# EAGLE design ALU (EAGLE 9.6.2)
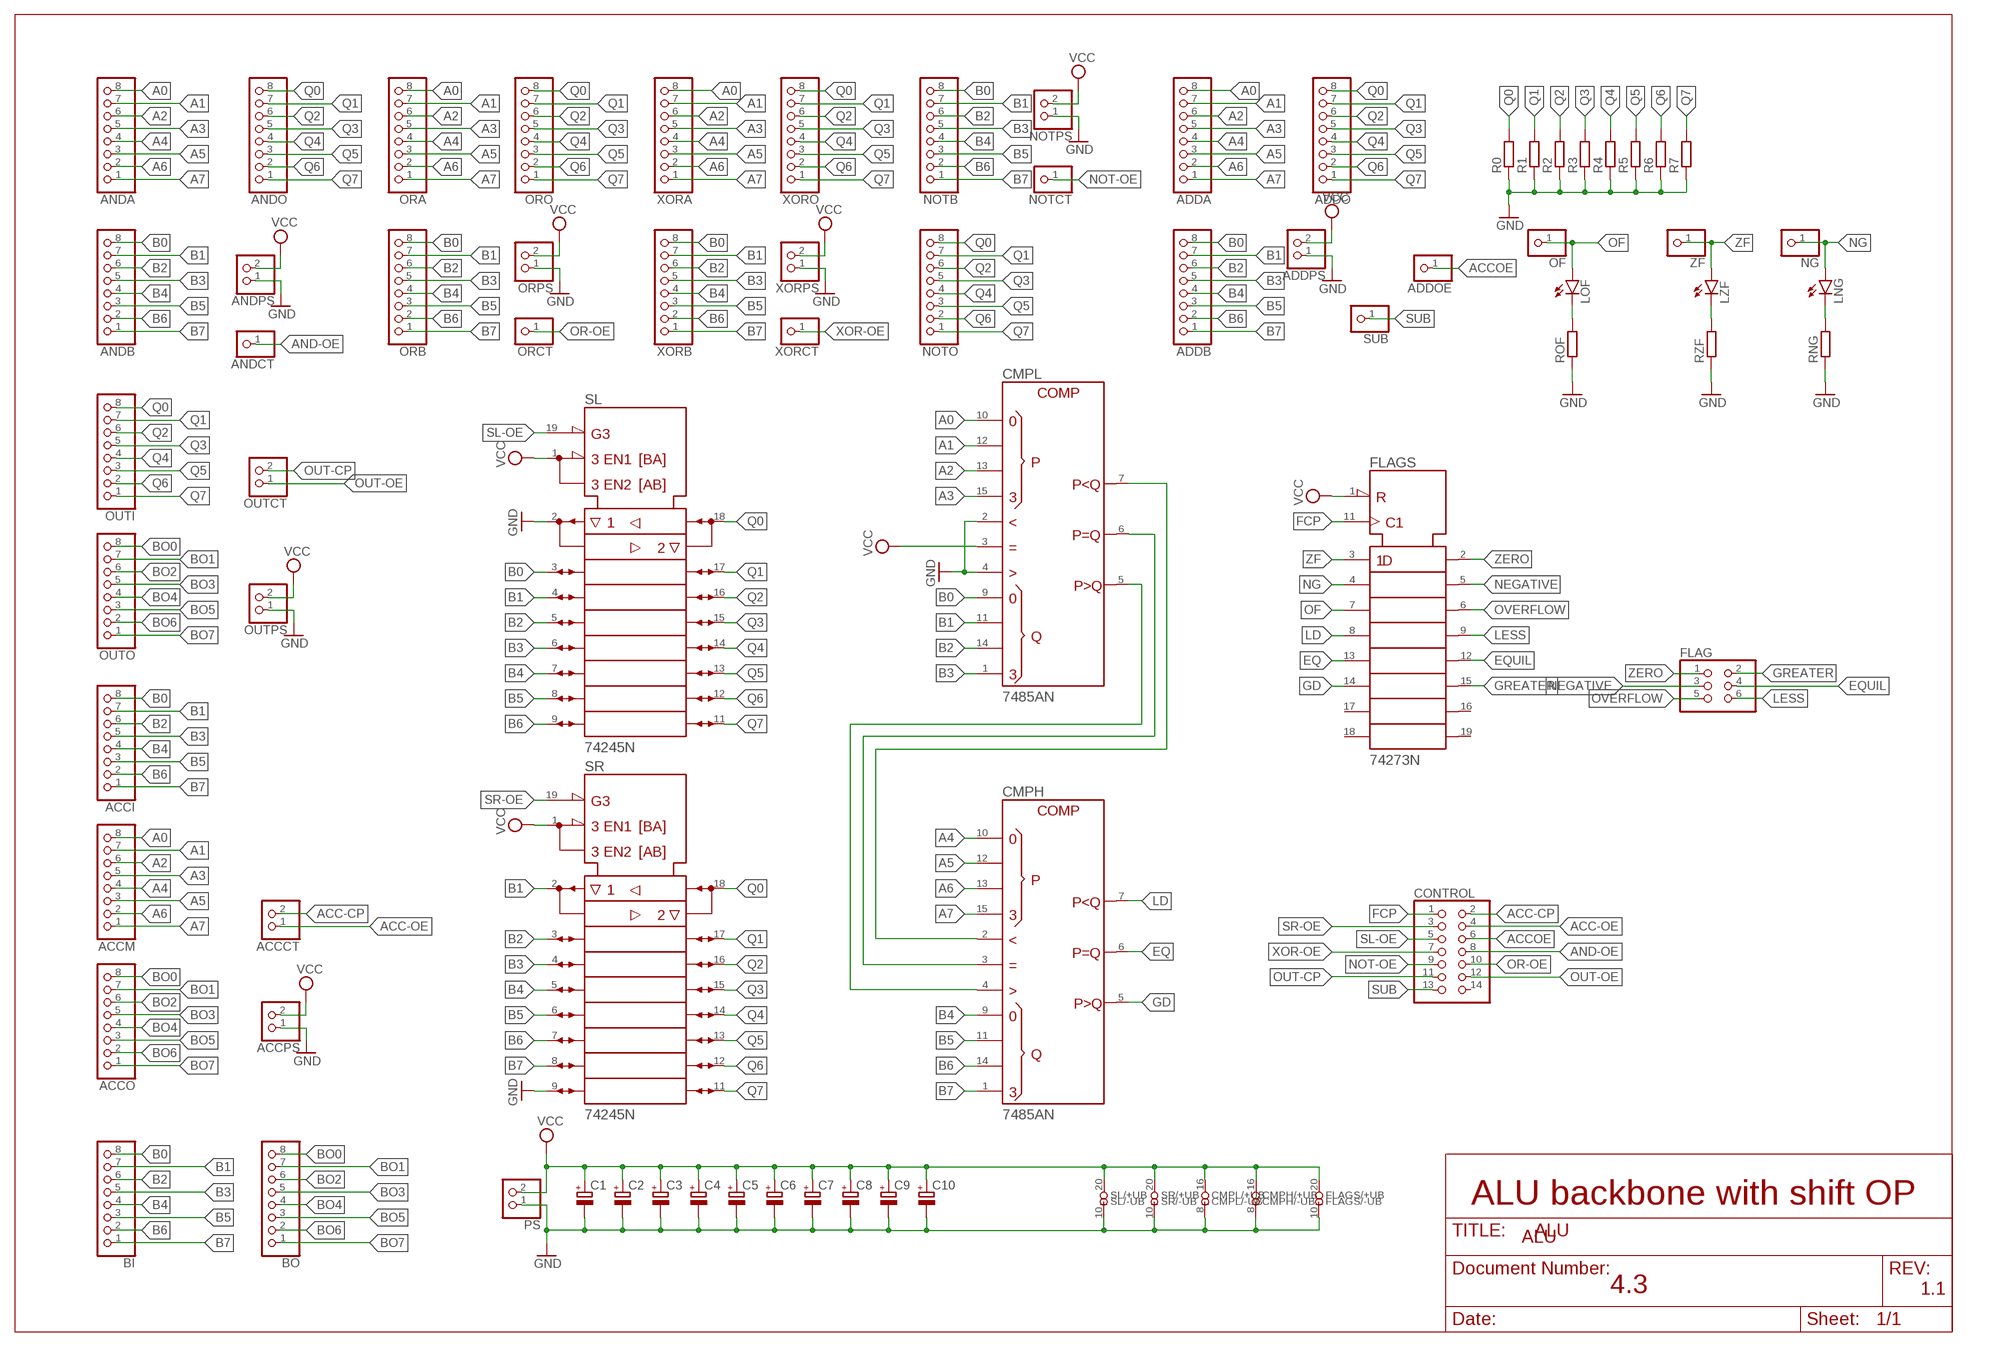
[diagram p0: schematic, sheet 1]

## Parts
ACCCT  PINHD-1X2  [1X02]
ACCI  PINHD-1X8  [1X08]
ACCM  PINHD-1X8  [1X08]
ACCO  PINHD-1X8  [1X08]
ACCPS  PINHD-1X2  [1X02]
ADDA  PINHD-1X8  [1X08]
ADDB  PINHD-1X8  [1X08]
ADDO  PINHD-1X8  [1X08]
ADDOE  PINHD-1X1  [1X01]
ADDPS  PINHD-1X2  [1X02]
ANDA  PINHD-1X8  [1X08]
ANDB  PINHD-1X8  [1X08]
ANDCT  PINHD-1X1  [1X01]
ANDO  PINHD-1X8  [1X08]
ANDPS  PINHD-1X2  [1X02]
BI  PINHD-1X8  [1X08]
BO  PINHD-1X8  [1X08]
C1  CPOL-EUE2.5-6  [E2,5-6]
C2  CPOL-EUE2.5-6  [E2,5-6]
C3  CPOL-EUE2.5-6  [E2,5-6]
C4  CPOL-EUE2.5-6  [E2,5-6]
C5  CPOL-EUE2.5-6  [E2,5-6]
C6  CPOL-EUE2.5-6  [E2,5-6]
C7  CPOL-EUE2.5-6  [E2,5-6]
C8  CPOL-EUE2.5-6  [E2,5-6]
C9  CPOL-EUE2.5-6  [E2,5-6]
C10  CPOL-EUE2.5-6  [E2,5-6]
CMPH  7485AN  [DIL16]
CMPL  7485AN  [DIL16]
CONTROL  PINHD-2X7  [2X07]
FLAG  PINHD-2X3  [2X03]
FLAGS  74273N  [DIL20]
LNG  LED5MM  [LED5MM]
LOF  LED5MM  [LED5MM]
LZF  LED5MM  [LED5MM]
NG  PINHD-1X1  [1X01]
NOTB  PINHD-1X8  [1X08]
NOTCT  PINHD-1X1  [1X01]
NOTO  PINHD-1X8  [1X08]
NOTPS  PINHD-1X2  [1X02]
OF  PINHD-1X1  [1X01]
ORA  PINHD-1X8  [1X08]
ORB  PINHD-1X8  [1X08]
ORCT  PINHD-1X1  [1X01]
ORO  PINHD-1X8  [1X08]
ORPS  PINHD-1X2  [1X02]
OUTCT  PINHD-1X2  [1X02]
OUTI  PINHD-1X8  [1X08]
OUTO  PINHD-1X8  [1X08]
OUTPS  PINHD-1X2  [1X02]
PS  PINHD-1X2  [1X02]
R0  R-EU_0204/7  [0204/7]
R1  R-EU_0204/7  [0204/7]
R2  R-EU_0204/7  [0204/7]
R3  R-EU_0204/7  [0204/7]
R4  R-EU_0204/7  [0204/7]
R5  R-EU_0204/7  [0204/7]
R6  R-EU_0204/7  [0204/7]
R7  R-EU_0204/7  [0204/7]
RNG  R-EU_0204/7  [0204/7]
ROF  R-EU_0204/7  [0204/7]
RZF  R-EU_0204/7  [0204/7]
SL  74245N  [DIL20]
SR  74245N  [DIL20]
SUB  PINHD-1X1  [1X01]
XORA  PINHD-1X8  [1X08]
XORB  PINHD-1X8  [1X08]
XORCT  PINHD-1X1  [1X01]
XORO  PINHD-1X8  [1X08]
XORPS  PINHD-1X2  [1X02]
ZF  PINHD-1X1  [1X01]

## Nets
A0: ACCM.8 ADDA.8 ANDA.8 CMPL.10(P0) ORA.8 XORA.8
A1: ACCM.7 ADDA.7 ANDA.7 CMPL.12(P1) ORA.7 XORA.7
A2: ACCM.6 ADDA.6 ANDA.6 CMPL.13(P2) ORA.6 XORA.6
A3: ACCM.5 ADDA.5 ANDA.5 CMPL.15(P3) ORA.5 XORA.5
A4: ACCM.4 ADDA.4 ANDA.4 CMPH.10(P0) ORA.4 XORA.4
A5: ACCM.3 ADDA.3 ANDA.3 CMPH.12(P1) ORA.3 XORA.3
A6: ACCM.2 ADDA.2 ANDA.2 CMPH.13(P2) ORA.2 XORA.2
A7: ACCM.1 ADDA.1 ANDA.1 CMPH.15(P3) ORA.1 XORA.1
ACC-CP: ACCCT.2 CONTROL.2
ACC-OE: ACCCT.1 CONTROL.4
ACCOE: ADDOE.1 CONTROL.6
AND-OE: ANDCT.1 CONTROL.8
B0: ACCI.8 ADDB.8 ANDB.8 BI.8 CMPL.9(Q0) NOTB.8 ORB.8 SL.3(A2) XORB.8
B1: ACCI.7 ADDB.7 ANDB.7 BI.7 CMPL.11(Q1) NOTB.7 ORB.7 SL.4(A3) SR.2(A1) XORB.7
B2: ACCI.6 ADDB.6 ANDB.6 BI.6 CMPL.14(Q2) NOTB.6 ORB.6 SL.5(A4) SR.3(A2) XORB.6
B3: ACCI.5 ADDB.5 ANDB.5 BI.5 CMPL.1(Q3) NOTB.5 ORB.5 SL.6(A5) SR.4(A3) XORB.5
B4: ACCI.4 ADDB.4 ANDB.4 BI.4 CMPH.9(Q0) NOTB.4 ORB.4 SL.7(A6) SR.5(A4) XORB.4
B5: ACCI.3 ADDB.3 ANDB.3 BI.3 CMPH.11(Q1) NOTB.3 ORB.3 SL.8(A7) SR.6(A5) XORB.3
B6: ACCI.2 ADDB.2 ANDB.2 BI.2 CMPH.14(Q2) NOTB.2 ORB.2 SL.9(A8) SR.7(A6) XORB.2
B7: ACCI.1 ADDB.1 ANDB.1 BI.1 CMPH.1(Q3) NOTB.1 ORB.1 SR.8(A7) XORB.1
BO0: ACCO.8 BO.8 OUTO.8
BO1: ACCO.7 BO.7 OUTO.7
BO2: ACCO.6 BO.6 OUTO.6
BO3: ACCO.5 BO.5 OUTO.5
BO4: ACCO.4 BO.4 OUTO.4
BO5: ACCO.3 BO.3 OUTO.3
BO6: ACCO.2 BO.2 OUTO.2
BO7: ACCO.1 BO.1 OUTO.1
EQ: CMPH.6(PEQQ) FLAGS.13(5D)
EQUIL: FLAG.4 FLAGS.12(5Q)
FCP: CONTROL.1 FLAGS.11(CLK)
GD: CMPH.5(PGTQ) FLAGS.14(6D)
GND: ACCPS.1 ADDPS.1 ANDPS.1 C1.- C2.- C3.- C4.- C5.- C6.- C7.- C8.- C9.- C10.- CMPH.8(-UB) CMPL.2(PLTQ_) CMPL.4(PGTQ_) CMPL.8(-UB) FLAGS.10(-UB) NOTPS.1 ORPS.1 OUTPS.1 PS.1 R0.1 R1.1 R2.1 R3.1 R4.1 R5.1 R6.1 R7.1 RNG.1 ROF.1 RZF.1 SL.2(A1) SL.10(-UB) SR.9(A8) SR.10(-UB) XORPS.1
GREATER: FLAG.2 FLAGS.15(6Q)
LD: CMPH.7(PLTQ) FLAGS.8(4D)
LESS: FLAG.6 FLAGS.9(4Q)
N$1: LOF.K(C) ROF.2
N$2: LZF.K(C) RZF.2
N$3: LNG.K(C) RNG.2
N$26: CMPH.4(PGTQ_) CMPL.5(PGTQ)
N$27: CMPH.3(PEQQ_) CMPL.6(PEQQ)
N$28: CMPH.2(PLTQ_) CMPL.7(PLTQ)
NEGATIVE: FLAG.3 FLAGS.5(2Q)
NG: FLAGS.4(2D) LNG.A NG.1
NOT-OE: CONTROL.9 NOTCT.1
OF: FLAGS.7(3D) LOF.A OF.1
OR-OE: CONTROL.10 ORCT.1
OUT-CP: CONTROL.11 OUTCT.2
OUT-OE: CONTROL.12 OUTCT.1
OVERFLOW: FLAG.5 FLAGS.6(3Q)
Q0: ADDO.8 ANDO.8 NOTO.8 ORO.8 OUTI.8 R0.2 SL.18(B1) SR.18(B1) XORO.8
Q1: ADDO.7 ANDO.7 NOTO.7 ORO.7 OUTI.7 R1.2 SL.17(B2) SR.17(B2) XORO.7
Q2: ADDO.6 ANDO.6 NOTO.6 ORO.6 OUTI.6 R2.2 SL.16(B3) SR.16(B3) XORO.6
Q3: ADDO.5 ANDO.5 NOTO.5 ORO.5 OUTI.5 R3.2 SL.15(B4) SR.15(B4) XORO.5
Q4: ADDO.4 ANDO.4 NOTO.4 ORO.4 OUTI.4 R4.2 SL.14(B5) SR.14(B5) XORO.4
Q5: ADDO.3 ANDO.3 NOTO.3 ORO.3 OUTI.3 R5.2 SL.13(B6) SR.13(B6) XORO.3
Q6: ADDO.2 ANDO.2 NOTO.2 ORO.2 OUTI.2 R6.2 SL.12(B7) SR.12(B7) XORO.2
Q7: ADDO.1 ANDO.1 NOTO.1 ORO.1 OUTI.1 R7.2 SL.11(B8) SR.11(B8) XORO.1
SL-OE: CONTROL.5 SL.19(!G)
SR-OE: CONTROL.3 SR.19(!G)
SUB: CONTROL.13 SUB.1
VCC: ACCPS.2 ADDPS.2 ANDPS.2 C1.+ C2.+ C3.+ C4.+ C5.+ C6.+ C7.+ C8.+ C9.+ C10.+ CMPH.16(+UB) CMPL.3(PEQQ_) CMPL.16(+UB) FLAGS.1(!CLR) FLAGS.20(+UB) NOTPS.2 ORPS.2 OUTPS.2 PS.2 SL.1(DIR) SL.20(+UB) SR.1(DIR) SR.20(+UB) XORPS.2
XOR-OE: CONTROL.7 XORCT.1
ZERO: FLAG.1 FLAGS.2(1Q)
ZF: FLAGS.3(1D) LZF.A ZF.1
Unconnected: CONTROL.14 FLAGS.16(7Q) FLAGS.17(7D) FLAGS.18(8D) FLAGS.19(8Q)

## Notes on the sheet
- ALU backbone with shift OP
- ALU
- 4.3 | 1.1

## Library data of the parts
ACCCT ACCPS ADDPS ANDPS NOTPS ORPS OUTCT OUTPS PS XORPS = pinhead:PINHD-1X2: PIN HEADER
ACCI ACCM ACCO ADDA ADDB ADDO ANDA ANDB ANDO BI BO NOTB NOTO ORA ORB ORO OUTI OUTO XORA XORB XORO = pinhead:PINHD-1X8: PIN HEADER
ADDOE ANDCT NG NOTCT OF ORCT SUB XORCT ZF = pinhead:PINHD-1X1: PIN HEADER
C1-C10 = rcl:CPOL-EU: POLARIZED CAPACITOR, European symbol; SPICEPREFIX: C
CMPH CMPL = 74ttl-din:74*85A: 4-bit Magnitude COMPARATOR
CONTROL = pinhead:PINHD-2X7: PIN HEADER
FLAG = pinhead:PINHD-2X3: PIN HEADER
FLAGS = 74ttl-din:74*273: Octal D type FLIP FLOP, clear
LNG LOF LZF = led:LED: LED OSRAM: - CHIPLED LG R971, LG N971, LY N971, LG Q971, LY Q971, LO R971, LY R971 LH N974, LH R974 LS Q976, LO Q976, LY Q976 LO Q996 - Hyper CHIPLED LW Q18S LB Q993, LB Q99A, LB R99A - SideLED LS A670, LO A670, LY A670, LG A670, LP A670 LB A673, LV A673, LT A673, LW A673 LH A674 LY A675 LS A676, LA A676, LO A676, LY A676, LW A676 LS A679, LY A679, LG A679 - Hyper Micro SIDELED® LS Y876, LA Y876, LO Y876, LY Y876 LT Y87S - SmartLED LW L88C, LW L88S LB L89C, LB L89S, LG L890 LS L89K, LO L89K, LY L89K LS L896, LA L896, LO L896, LY L896 - TOPLED LS T670, LO T670, LY T670, LG T670, LP T670 LSG T670, LSP T670, LSY T670, LOP T670, LYG T670 LG T671, LOG T671, LSG T671 LB T673, LV T673, LT T673, LW T673 LH T674 LS T676, LA T676, LO T676, LY T676, LB T676, LH T676, LSB T676, LW T676 LB T67C, LV T67C, LT T67C, LS T67K, LO T67K, LY T67K, LW E67C LS E67B, LA E67B, LO E67B, LY E67B, LB E67C, LV E67C, LT E67C LW T67C LS T679, LY T679, LG T679 LS T770, LO T770, LY T770, LG T770, LP T770 LB T773, LV T773, LT T773, LW T773 LH T774 LS E675, LA E675, LY E675, LS T675 LS T776, LA T776, LO T776, LY T776, LB T776 LHGB T686 LT T68C, LB T68C - Hyper Mini TOPLED® LB M676 - Mini TOPLED Santana® LG M470 LS M47K, LO M47K, LY M47K Source: http://www.osram.convergy.de LUXEON: - LUMILED® LXK2-PW12-R00, LXK2-PW12-S00, LXK2-PW14-U00, LXK2-PW14-V00 LXK2-PM12-R00, LXK2-PM12-S00, LXK2-PM14-U00 LXK2-PE12-Q00, LXK2-PE12-R00, LXK2-PE12-S00, LXK2-PE14-T00, LXK2-PE14-U00 LXK2-PB12-K00, LXK2-PB12-L00, LXK2-PB12-M00, LXK2-PB14-N00, LXK2-PB14-P00, LXK2-PB14-Q00 LXK2-PR12-L00, LXK2-PR12-M00, LXK2-PR14-Q00, LXK2-PR14-R00 LXK2-PD12-Q00, LXK2-PD12-R00, LXK2-PD12-S00 LXK2-PH12-R00, LXK2-PH12-S00 LXK2-PL12-P00, LXK2-PL12-Q00, LXK2-PL12-R00 Source: www.luxeon.com KINGBRIGHT: KA-3528ASYC Source: www.kingbright.com
R0 R1-R7 RNG ROF RZF = rcl:R-EU_: RESISTOR, European symbol; SPICEPREFIX: R
SL SR = 74ttl-din:74*245: Octal BUS TRANSCEIVER, 3-state

## Board
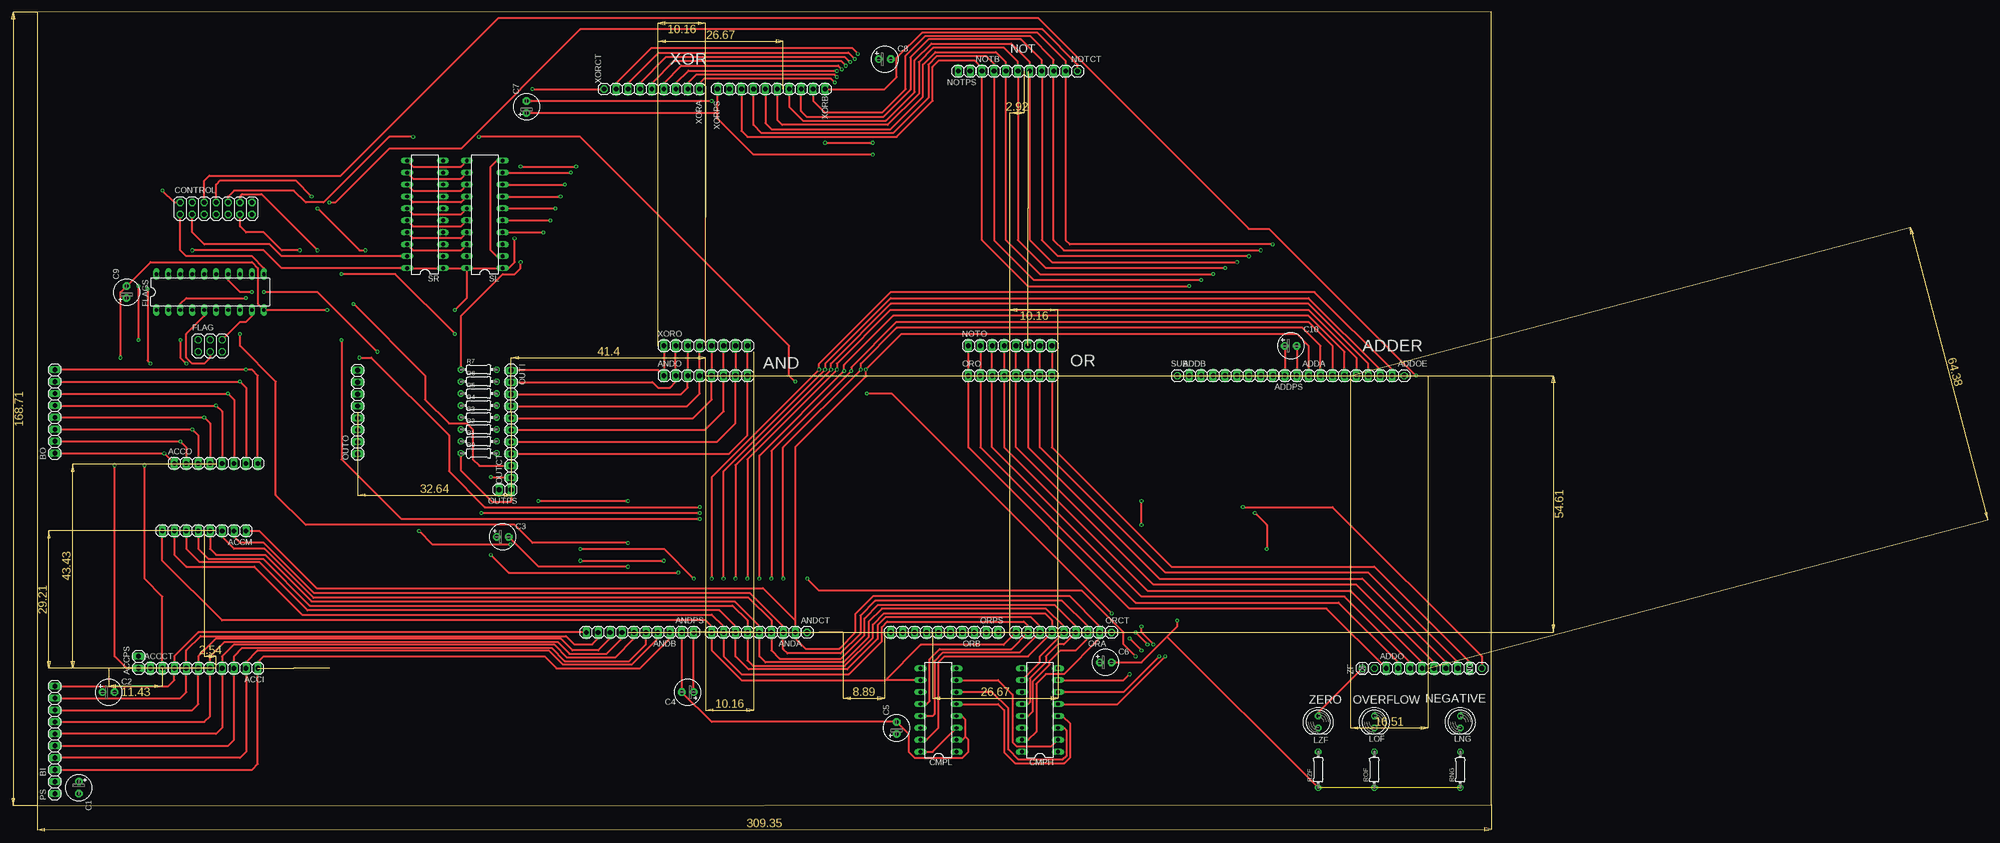
[diagram p1: board, top side]
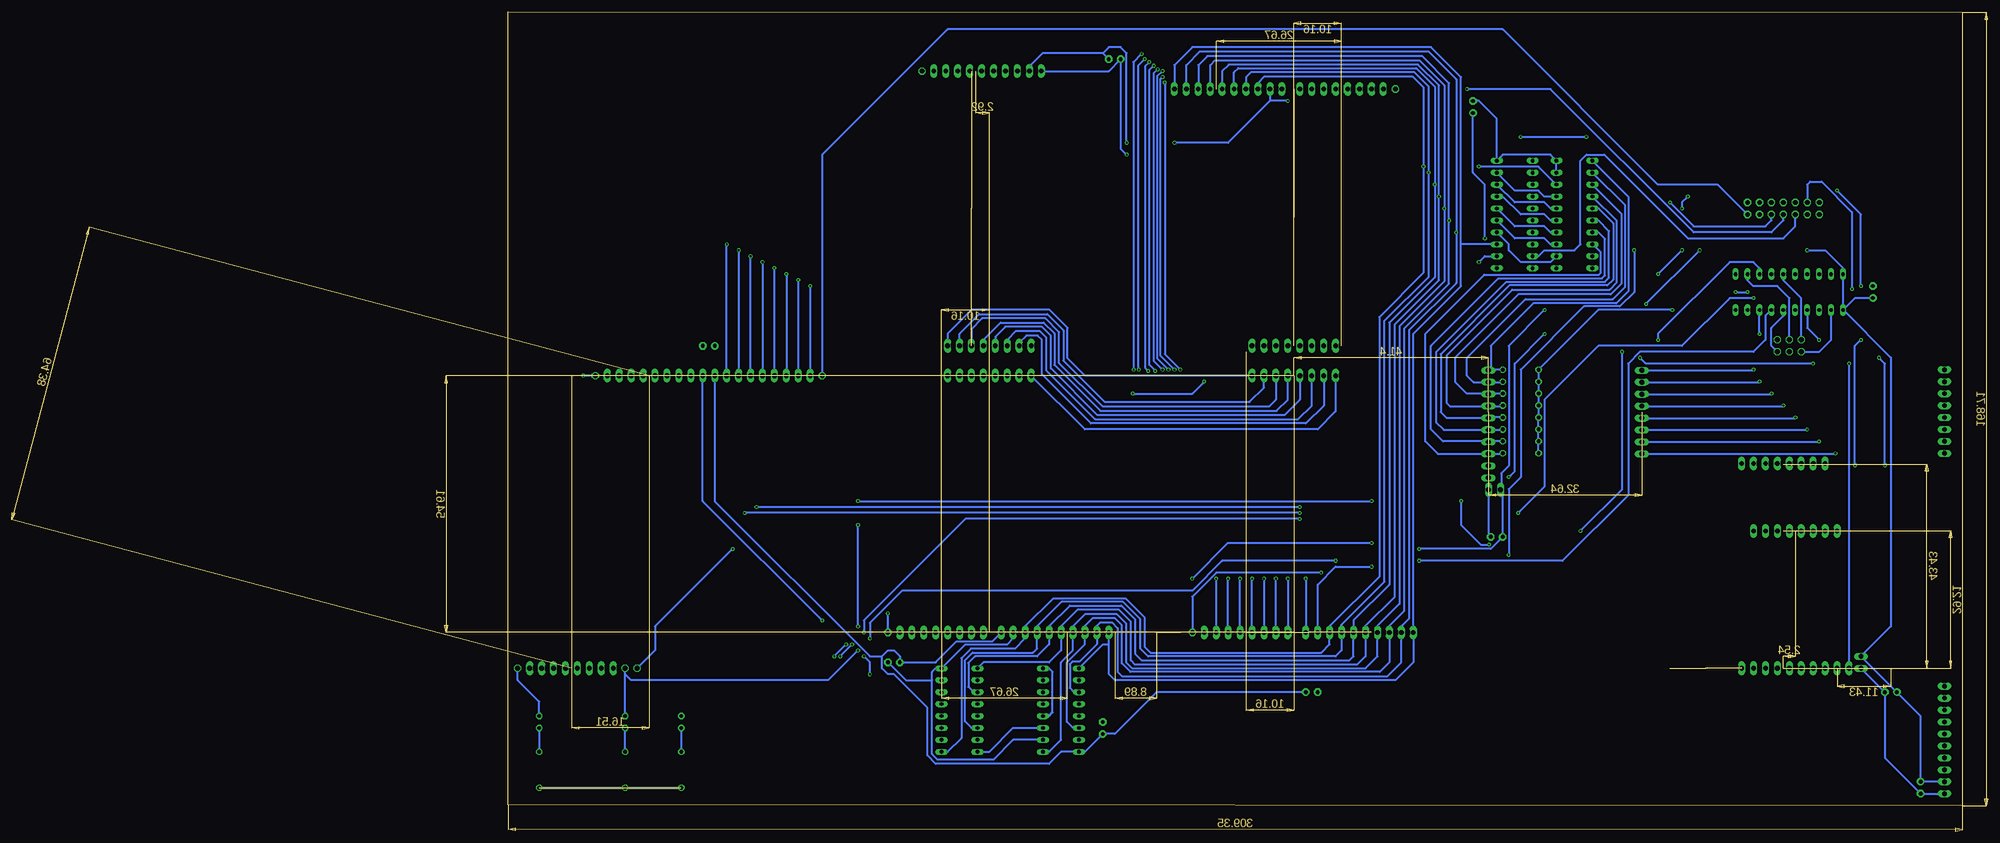
[diagram p2: board, bottom side, seen from below]

Size 309.35 x 168.83 mm. Coordinates in mm from the lower left corner, seen from the top.
Outline: 0,0 309.35,0.13 309.35,168.83 0,168.71 0,0
Copper layers (1*16): Top 0.035mm / dielectric 1.5mm / Bottom 0.035mm
Design rules "default": minimum track width 6mil, minimum drill 0.35mm, track to track 6mil, track to pad 6mil, pad to pad 6mil, via to via 6mil, smd to smd 6mil, copper to edge 40mil, drill to drill 6mil, minimum pad ring 10mil, minimum via ring 8mil, stop-mask expansion 4mil, vias tented up to drill 0mil, thermal gap 10mil

### Footprints (pad centres in the part's own frame; a part is rotated, then mirrored left to right if it is on the bottom)
1X02 = drill 1.016 long: 1 -1.27,0; 2 1.27,0
1X08 = drill 1.016 long: 1 -8.89,0; 2 -6.35,0; 3 -3.81,0; 4 -1.27,0; 5 1.27,0; 6 3.81,0; 7 6.35,0; 8 8.89,0
1X01 = drill 1.016 octagon: 1 0,0
E2,5-6 = drill 0.813 pad 1.6: + -1.27,0 | drill 0.813 pad 1.6 octagon: - 1.27,0
DIL16 = drill 0.813 long: 1 -8.89,-3.81; 2 -6.35,-3.81; 3 -3.81,-3.81; 4 -1.27,-3.81; 5 1.27,-3.81; 6 3.81,-3.81; 7 6.35,-3.81; 8 8.89,-3.81; 9 8.89,3.81; 10 6.35,3.81; 11 3.81,3.81; 12 1.27,3.81; 13 -1.27,3.81; 14 -3.81,3.81; 15 -6.35,3.81; 16 -8.89,3.81
2X07 = drill 1.016 octagon: 1 -7.62,-1.27; 2 -7.62,1.27; 3 -5.08,-1.27; 4 -5.08,1.27; 5 -2.54,-1.27; 6 -2.54,1.27; 7 0,-1.27; 8 0,1.27; 9 2.54,-1.27; 10 2.54,1.27; 11 5.08,-1.27; 12 5.08,1.27; 13 7.62,-1.27; 14 7.62,1.27
2X03 = drill 1.016 octagon: 1 -2.54,-1.27; 2 -2.54,1.27; 3 0,-1.27; 4 0,1.27; 5 2.54,-1.27; 6 2.54,1.27
DIL20 = drill 0.813 long: 1 -11.43,-3.81; 2 -8.89,-3.81; 3 -6.35,-3.81; 4 -3.81,-3.81; 5 -1.27,-3.81; 6 1.27,-3.81; 7 3.81,-3.81; 8 6.35,-3.81; 9 8.89,-3.81; 10 11.43,-3.81; 11 11.43,3.81; 12 8.89,3.81; 13 6.35,3.81; 14 3.81,3.81; 15 1.27,3.81; 16 -1.27,3.81; 17 -3.81,3.81; 18 -6.35,3.81; 19 -8.89,3.81; 20 -11.43,3.81
LED5MM = drill 0.813 octagon: A -1.27,0; K 1.27,0
0204/7 = drill 0.813 octagon: 1 -3.81,0; 2 3.81,0

### Placement (x,y rotation side)
ACCCT  25.4,29.21 0 top
ACCI  38.1,29.21 180 top
ACCM  35.56,58.42 180 top
ACCO  38.1,72.77 0 top
ACCPS  21.59,30.48 90 top
ADDA  279.4,91.44 0 top
ADDB  254,91.44 0 top
ADDO  295.91,29.21 0 top
ADDOE  290.83,91.44 0 top
ADDPS  266.7,91.44 180 top
ANDA  152.4,36.83 180 top
ANDB  125.73,36.83 180 top
ANDCT  163.83,36.83 0 top
ANDO  142.24,91.44 0 top
ANDPS  138.43,36.83 0 top
BI  3.81,16.51 90 top
BO  3.81,83.82 90 top
C1  8.89,3.81 270 top
C2  15.24,24.13 0 top
C3  99.06,57.15 0 top
C4  138.43,24.13 180 top
C5  182.88,16.51 90 top
C6  227.33,30.48 0 top
C7  104.14,148.59 90 top
C8  180.34,158.75 0 top
C9  19.05,109.22 90 top
C10  266.7,97.79 0 top
CMPH  213.36,20.32 90 top
CMPL  191.77,20.32 90 top
CONTROL  38.1,127 0 top
FLAG  36.83,97.79 0 top
FLAGS  36.83,109.22 0 top
LNG  302.77,17.78 270 top
LOF  284.48,17.78 270 top
LZF  272.54,17.78 270 top
NG  307.34,29.21 90 top
NOTB  209.93,156.21 0 top
NOTCT  221.36,156.21 0 top
NOTO  207.01,97.79 0 top
NOTPS  197.23,156.21 180 top
OF  284.48,29.21 90 top
ORA  217.17,36.83 180 top
ORB  190.5,36.83 180 top
ORCT  228.6,36.83 0 top
ORO  207.01,91.44 0 top
ORPS  203.2,36.83 0 top
OUTCT  100.84,70.99 90 top
OUTI  100.84,83.69 270 top
OUTO  68.2,83.69 90 top
OUTPS  99.57,67.18 180 top
PS  3.81,3.81 90 top
R0  93.98,74.93 0 top
R1  93.98,77.47 0 top
R2  93.98,80.01 0 top
R3  93.98,82.55 0 top
R4  93.98,85.09 0 top
R5  93.98,87.63 0 top
R6  93.98,90.17 0 top
R7  93.98,92.71 0 top
RNG  302.77,7.62 90 top
ROF  284.48,7.62 90 top
RZF  272.54,7.62 90 top
SL  95.25,125.73 90 top
SR  82.55,125.73 90 top
SUB  242.57,91.44 0 top
XORA  132.08,152.4 0 top
XORB  158.75,152.4 0 top
XORCT  120.65,152.4 0 top
XORO  142.24,97.79 0 top
XORPS  146.05,152.4 180 top
ZF  281.94,29.21 90 top

### Tracks (layer width: path | path; a pad name or v marks a point on that pad's centre or on a via)
A0  (via drill 0.35)
  Top 0.4: ORA.8 205.61,34.16 187.96,34.16 180.47,26.67 | 180.47,26.67 149.86,26.67 143.51,33.02 ANDA.8 143.51,38.1 142.24,39.37 39.37,39.37 26.67,52.07 ACCM.8 | XORA.8 140.97,153.67 141.99,154.69 168.78,154.69 v169.67,153.8 | v143.51,48.26 143.51,69.85 v166.37,92.71 166.37,93.98 181.61,109.22 271.78,109.22 288.29,92.71 ADDA.8 | CMPL.10 180.47,26.67
  Bottom 0.4: v169.67,153.8 169.67,96.01 v166.37,92.71 | v143.51,48.26 ANDA.8
A1  (via drill 0.35)
  Top 0.4: v146.05,48.26 146.05,71.12 v167.64,92.71 167.64,93.98 181.61,107.95 270.51,107.95 285.75,92.71 ADDA.7 | v170.18,154.94 169.67,155.45 140.21,155.45 138.43,153.67 XORA.7 | CMPL.12 189.23,21.59 189.87,22.23 189.87,31.11 192.02,33.27 207.26,33.27 ORA.7 210.95,36.96 210.95,38.1 209.93,39.12 180.85,39.12 179.71,37.97 179.71,34.92 172.72,27.94 149.86,27.94 146.05,31.75 ANDA.7 146.05,38.1 143.51,40.64 56.39,40.64 46.23,50.8 31.75,50.8 29.21,53.34 ACCM.7
  Bottom 0.4: ANDA.7 v146.05,48.26 | v170.18,154.94 170.56,154.56 170.56,95.63 v167.64,92.71
A2  (via drill 0.35)
  Top 0.4: XORA.6 135.89,153.67 138.56,156.34 170.05,156.34 v170.18,156.21 | v148.59,48.26 148.59,72.39 v168.91,92.71 168.91,93.98 181.61,106.68 270.51,106.68 283.21,93.98 ADDA.6 | CMPL.13 190.5,19.05 190.88,19.43 190.88,30.73 192.66,32.51 209.04,32.51 ORA.6 213.36,38.1 211.46,40.01 180.47,40.01 178.82,38.35 178.82,35.43 172.34,28.96 151.38,28.96 148.59,31.75 ANDA.6 148.59,38.1 145.16,41.53 57.53,41.53 47.24,51.82 34.54,51.82 31.75,54.61 ACCM.6
  Bottom 0.4: v170.18,156.21 171.32,155.07 171.32,95.12 v168.91,92.71 | v148.59,48.26 ANDA.6
A3  (via drill 0.35)
  Top 0.4: XORA.5 133.35,153.67 137.03,157.35 170.43,157.35 v171.2,156.59 | v151.13,48.26 151.13,73.66 v170.18,92.71 170.18,93.98 181.61,105.41 270.51,105.41 280.67,95.25 ADDA.5 | CMPL.15 189.23,13.97 191.77,16.51 191.77,30.48 193.04,31.75 210.82,31.75 ORA.5 215.9,39.37 214.38,40.89 180.21,40.89 177.8,38.48 177.8,35.69 171.83,29.72 152.27,29.72 151.13,30.86 ANDA.5 151.13,39.37 147.96,42.55 58.04,42.55 48.13,52.45 36.45,52.45 34.29,54.61 ACCM.5
  Bottom 0.4: ANDA.5 v151.13,48.26 | v171.2,156.59 172.09,155.7 172.09,94.61 v170.18,92.71
A4  (via drill 0.35)
  Top 0.4: XORA.4 130.81,153.67 135.51,158.37 171.07,158.37 v172.09,157.35 | v153.67,48.26 153.67,74.42 v171.7,92.46 171.7,93.73 182.12,104.14 270.51,104.14 278.13,96.52 ADDA.4 | CMPH.10 213.36,30.48 213.36,31.75 ORA.4 218.44,38.1 214.63,41.91 179.71,41.91 176.91,39.12 176.91,35.81 171.58,30.48 154.94,30.48 153.67,31.75 ANDA.4 153.67,38.1 148.34,43.43 58.42,43.43 48.51,53.34 38.1,53.34 36.83,54.61 ACCM.4
  Bottom 0.4: ANDA.4 v153.67,48.26 | v172.09,157.35 172.97,156.46 172.97,93.73 v171.7,92.46
A5  (via drill 0.35)
  Top 0.4: XORA.3 128.27,153.67 133.86,159.26 171.83,159.26 v172.97,158.12 | v156.21,48.26 156.21,75.44 v173.23,92.46 173.23,93.22 182.88,102.87 270.51,102.87 275.59,97.79 ADDA.3 | CMPH.12 210.82,21.59 211.22,21.99 211.22,27.07 214.63,30.48 214.63,31.75 217.17,34.29 218.44,34.29 ORA.3 220.98,38.1 216.41,42.67 178.94,42.67 176.02,39.75 176.02,36.2 171.07,31.24 157.99,31.24 156.21,33.02 ANDA.3 156.21,39.37 151.38,44.2 58.8,44.2 48.39,54.61 41.91,54.61 39.37,57.15 ACCM.3
  Bottom 0.4: ANDA.3 v156.21,48.26 | v172.97,158.12 173.86,157.23 173.86,93.09 v173.23,92.46
A6  (via drill 0.35)
  Top 0.4: XORA.2 125.73,153.67 132.21,160.15 172.59,160.15 v173.99,158.75 | v158.75,48.26 158.75,76.2 v175.26,92.71 175.26,93.98 182.88,101.6 269.24,101.6 273.05,97.79 ADDA.2 | CMPH.13 210.82,19.05 211.84,20.07 211.84,26.42 215.39,29.97 215.39,30.73 217.68,33.02 220.98,33.02 223.52,35.56 ORA.2 223.52,38.1 218.06,43.56 178.31,43.56 175.13,40.39 175.13,36.58 170.94,32.38 159.64,32.38 158.75,33.27 ANDA.2 158.75,38.1 151.64,45.21 58.93,45.21 48.26,55.88 43.18,55.88 41.91,57.15 ACCM.2
  Bottom 0.4: ANDA.2 v158.75,48.26 | v173.99,158.75 175.26,157.48 v175.26,92.71
A7  (via drill 0.35)
  Top 0.4: ANDA.1 161.29,39.37 154.43,46.23 59.44,46.23 47.24,58.42 ACCM.1 | ANDA.1 161.29,35.56 163.45,33.4 170.69,33.4 174.12,36.83 174.12,40.77 177.93,44.58 219.58,44.58 226.06,38.1 ORA.1 226.06,35.56 218.44,27.94 214.63,27.94 212.6,25.91 212.6,15.75 210.82,13.97 CMPH.15 | XORA.1 123.19,153.67 130.68,161.16 173.35,161.16 v174.62,159.89 | ANDA.1 161.29,76.2 176.28,91.19 v176.28,92.71 183.9,100.33 267.97,100.33 270.51,97.79 ADDA.1
  Bottom 0.4: v174.62,159.89 176.4,158.12 176.4,92.84 v176.28,92.71
ACC-CP  (via drill 0.35)
  Top 0.4: v22.86,72.39 22.86,48.26 26.67,44.45 ACCCT.2 | v21.59,99.06 v21.59,110.49 | v26.67,130.81 29.21,128.27 CONTROL.2
  Bottom 0.4: v22.86,72.39 22.86,97.79 v21.59,99.06 | v21.59,110.49 21.59,125.73 v26.67,130.81
ACC-OE  (via drill 0.35)
  Top 0.4: v23.5,109.86 23.5,94.61 v24.13,93.98
  Bottom 0.4: v23.5,109.86 23.5,126.24 29.97,132.72 32.38,132.72 33.02,132.08 CONTROL.4 | v24.13,93.98 ACCCT.1
ACCOE  (via drill 0.35)
  Top 0.4: v293.36,91.43 262.12,122.68 257.8,122.68 212.97,167.51 98.14,167.51 64.62,133.99 36.63,133.99 35.56,132.91 CONTROL.6
  Bottom 0.4: ADDOE.1 v293.36,91.44 v293.36,91.43
AND-OE  (via drill 0.35)
  Top 0.4: v58.42,129.54 54.99,132.97 38.99,132.97 38.1,132.08 CONTROL.8 | v59.69,127 68.58,118.11 v69.85,118.11 | v96.52,53.34 100.33,49.53 v136.4,49.53
  Bottom 0.4: v58.42,129.54 59.69,128.27 v59.69,127 | v69.85,118.11 69.85,109.22 72.9,106.17 80.52,106.17 93.98,92.71 93.98,69.85 96.52,67.31 v96.52,53.34 | ANDCT.1 163.83,44.45 158.75,49.53 v136.4,49.53
B0  (via drill 0.35)
  Top 0.4: BI.8 27.94,25.4 29.21,26.67 ACCI.8 29.21,31.75 34.29,36.83 ANDB.8 | XORB.8 180.34,152.4 182.88,154.94 182.88,159 188.34,164.47 212.72,164.47 218.82,158.37 NOTB.8 218.82,120.27 219.71,119.38 v262.89,119.38
  Bottom 0.4: 181.61,34.29 181.61,27.94 180.34,26.67 120.65,26.67 116.84,30.48 ANDB.8 116.84,100.33 106.68,110.49 106.68,119.38 | 181.61,34.29 ORB.8 | XORB.8 167.64,157.48 163.83,161.29 113.03,161.29 106.68,154.94 106.68,119.38 | SL.3 106.68,119.38 | CMPL.9 182.88,34.29 181.61,34.29 | ADDB.8 v262.89,119.38
B1  (via drill 0.35)
  Top 0.4: BI.7 30.48,22.86 31.75,24.13 ACCI.7 31.75,33.02 34.8,36.07 112.52,36.07 114.3,34.29 118.11,34.29 119.38,35.56 ANDB.7 | XORB.7 165.1,149.86 167.51,147.45 179.83,147.45 184.78,152.4 184.78,159.51 188.98,163.7 211.2,163.7 216.28,158.62 NOTB.7 216.28,120.27 218.44,118.11 v260.35,118.11 | SL.4 v107.7,121.92
  Bottom 0.4: XORB.7 165.1,157.48 162.18,160.4 113.67,160.4 107.7,154.43 v107.7,121.92 107.7,111.12 117.73,101.09 117.73,39.75 119.38,38.1 ANDB.7 119.38,30.48 122.3,27.56 178.82,27.56 179.71,28.45 179.71,37.72 180.97,38.99 183.39,38.99 184.15,38.23 ORB.7 184.15,34.29 187.83,30.61 189.36,30.61 189.87,30.1 189.87,25.02 188.98,24.13 CMPL.11 | SR.2 87.63,115.57 93.98,115.57 96.52,118.11 96.52,119.38 SL.4 | v260.35,118.11 ADDB.7
B2  (via drill 0.35)
  Top 0.4: BI.6 33.02,20.32 34.29,21.59 ACCI.6 34.29,31.75 37.97,35.43 111.51,35.43 113.92,33.02 119.38,33.02 121.92,35.56 ANDB.6 | XORB.6 162.56,147.7 163.83,146.43 179.96,146.43 185.8,152.27 185.8,159.13 189.61,162.94 209.3,162.94 213.74,158.5 NOTB.6 213.74,120.27 217.17,116.84 v257.81,116.84 | SL.5 v109.22,124.46
  Bottom 0.4: XORB.6 162.56,157.48 160.66,159.38 114.94,159.38 109.22,153.67 v109.22,124.46 109.22,111 118.75,101.47 118.75,41.4 121.92,38.23 ANDB.6 121.92,30.48 123.95,28.45 177.04,28.45 178.82,30.23 178.82,38.35 180.34,39.88 185.04,39.88 186.69,38.23 ORB.6 186.69,34.29 190.5,30.48 190.5,17.78 189.23,16.51 CMPL.14 | SR.3 87.63,119.38 88.9,120.65 95.25,120.65 SL.5 | ADDB.6 v257.81,116.84
B3  (via drill 0.35)
  Top 0.4: BI.5 35.56,17.78 36.83,19.05 ACCI.5 36.83,31.75 39.88,34.8 110.74,34.8 113.28,32.26 121.16,32.26 124.46,35.56 ANDB.5 | XORB.5 160.02,148.59 162.94,145.67 180.59,145.67 186.69,151.76 186.69,158.5 190.25,162.05 207.26,162.05 211.2,158.12 NOTB.5 211.2,120.27 215.9,115.57 v255.27,115.57 | SL.6 v110.24,127
  Bottom 0.4: XORB.5 160.02,157.48 159,158.5 115.57,158.5 110.24,153.16 v110.24,127 110.24,111.51 119.76,101.98 119.76,42.93 124.46,38.23 ANDB.5 124.46,31.75 127,29.21 176.66,29.21 177.93,30.48 177.93,38.73 179.96,40.77 186.56,40.77 189.23,38.1 ORB.5 189.23,33.02 191.77,30.48 191.77,13.97 194.31,11.43 CMPL.1 | SR.4 87.63,121.92 88.9,123.19 95.25,123.19 SL.6 | v255.27,115.57 ADDB.5
B4  (via drill 0.35)
  Top 0.4: BI.4 38.1,15.24 39.37,16.51 ACCI.4 39.37,31.75 41.78,34.16 110.11,34.16 112.78,31.5 122.94,31.5 127,35.56 ANDB.4 | XORB.4 157.48,145.8 158.5,144.78 180.97,144.78 187.58,151.38 187.58,158.12 190.63,161.16 205.74,161.16 208.66,158.24 NOTB.4 208.66,120.27 214.63,114.3 v252.73,114.3 | SL.7 v111.38,129.54
  Bottom 0.4: XORB.4 157.48,156.21 156.08,157.61 115.82,157.61 111.38,153.16 v111.38,129.54 111.38,111.76 120.78,102.36 120.78,44.45 127,38.23 ANDB.4 127,31.75 128.78,29.97 176.02,29.97 176.91,30.86 176.91,39.12 179.45,41.66 188.21,41.66 191.77,38.1 ORB.4 191.77,33.02 194.31,30.48 208.28,30.48 CMPH.9 | SR.5 87.63,124.46 88.9,125.73 93.98,125.73 97.79,129.54 SL.7 | ADDB.4 v252.73,114.3
B5  (via drill 0.35)
  Top 0.4: BI.3 40.64,12.7 41.91,13.97 ACCI.3 41.91,31.75 43.69,33.53 109.47,33.53 112.27,30.73 125.98,30.73 129.54,34.29 ANDB.3 | XORB.3 154.94,145.16 156.21,143.89 181.61,143.89 188.47,150.75 188.47,157.61 191.13,160.27 203.96,160.27 206.12,158.12 NOTB.3 206.12,120.27 213.36,113.03 v250.19,113.03 | SL.8 v112.27,132.08
  Bottom 0.4: XORB.3 154.94,155.96 154.05,156.84 116.2,156.84 112.27,152.91 v112.27,132.08 112.27,112.39 121.92,102.74 121.92,46.99 129.54,39.37 ANDB.3 129.54,31.75 130.43,30.86 174.62,30.86 176.02,32.26 176.02,39.62 178.94,42.55 189.87,42.55 194.31,38.1 ORB.3 194.31,34.29 196.85,31.75 210.06,31.75 211.46,30.35 211.46,25.27 210.31,24.13 CMPH.11 | SR.6 87.63,127 88.9,128.27 95.25,128.27 SL.8 | v250.19,113.03 ADDB.3
B6  (via drill 0.35)
  Top 0.4: BI.2 43.18,10.16 44.45,11.43 ACCI.2 44.45,30.48 46.86,32.89 108.97,32.89 111.89,29.97 126.49,29.97 132.08,35.56 ANDB.2 | XORB.2 152.4,144.78 154.18,143 182.12,143 189.61,150.5 189.61,157.61 191.39,159.38 201.93,159.38 203.58,157.73 NOTB.2 203.58,120.27 212.09,111.76 v247.65,111.76 | SL.9 v113.54,134.62
  Bottom 0.4: XORB.2 152.4,154.94 151.38,155.96 116.59,155.96 113.54,152.91 v113.54,134.62 113.54,112.52 122.94,103.12 122.94,47.62 132.08,38.48 ANDB.2 132.08,33.02 133.35,31.75 173.23,31.75 174.88,33.4 174.88,39.62 178.56,43.31 191.64,43.31 196.85,38.1 ORB.2 196.85,33.4 197.74,32.51 210.57,32.51 212.22,30.86 212.22,17.91 210.82,16.51 CMPH.14 | SR.7 88.9,129.54 90.17,130.81 95.25,130.81 SL.9 | ADDB.2 v247.65,111.76
B7  (via drill 0.35)
  Top 0.4: BI.1 45.72,7.62 46.99,8.89 ACCI.1 46.99,30.48 48.26,31.75 107.95,31.75 110.49,29.21 128.27,29.21 134.62,35.56 ANDB.1 | XORB.1 149.86,143.51 151.13,142.24 182.88,142.24 190.5,149.86 190.5,157.1 191.9,158.5 199.39,158.5 201.04,156.84 NOTB.1 201.04,120.27 210.82,110.49 v245.11,110.49 | v102.87,135.89 v114.68,135.89
  Bottom 0.4: XORB.1 149.86,153.67 148.46,155.07 116.97,155.07 114.68,152.78 v114.68,135.89 114.68,113.28 124.08,103.89 124.08,48.64 134.62,38.1 ANDB.1 134.62,34.29 136.4,32.51 172.72,32.51 173.99,33.78 173.99,40.01 178.05,44.07 193.42,44.07 199.39,38.1 ORB.1 199.39,35.56 201.55,33.4 210.95,33.4 212.98,31.37 212.98,14.35 215.9,11.43 CMPH.1 | SR.8 90.17,135.89 v102.87,135.89 | v245.11,110.49 ADDB.1
BO0  (via drill 0.35)
  Top 0.4: BO.8 v44.45,92.71 45.72,92.71 46.99,91.44 ACCO.8
  Bottom 0.4: OUTO.8 44.58,92.58 v44.45,92.71
BO1  (via drill 0.35)
  Top 0.4: BO.7 v43.18,90.17 44.45,88.9 ACCO.7
  Bottom 0.4: OUTO.7 43.31,90.04 v43.18,90.17
BO2  (via drill 0.35)
  Top 0.4: BO.6 v40.64,87.63 41.91,86.36 ACCO.6
  Bottom 0.4: OUTO.6 40.77,87.5 v40.64,87.63
BO3  (via drill 0.35)
  Top 0.4: BO.5 v38.1,85.09 39.37,83.82 ACCO.5
  Bottom 0.4: OUTO.5 38.23,84.96 v38.1,85.09
BO4  (via drill 0.35)
  Top 0.4: BO.4 v35.56,82.55 36.83,81.28 ACCO.4
  Bottom 0.4: OUTO.4 35.69,82.42 v35.56,82.55
BO5  (via drill 0.35)
  Top 0.4: BO.3 v33.02,80.01 34.29,78.74 ACCO.3
  Bottom 0.4: OUTO.3 33.15,79.88 v33.02,80.01
BO6  (via drill 0.35)
  Top 0.4: BO.2 v30.48,77.47 31.75,76.2 ACCO.2
  Bottom 0.4: OUTO.2 30.61,77.34 v30.48,77.47
BO7  (via drill 0.35)
  Top 0.4: BO.1 v27.05,74.93 ACCO.1
  Bottom 0.4: OUTO.1 27.18,74.8 v27.05,74.93
EQ  (via drill 0.35)
  Top 0.4: v64.77,99.06 64.77,73.66 77.47,60.96 v140.97,60.96 | v233.68,36.83 v236.22,34.29 | v238.76,31.75 231.14,24.13 CMPH.6
  Bottom 0.4: FLAGS.13 43.18,114.3 44.45,115.57 49.53,115.57 64.77,100.33 v64.77,99.06 | v140.97,60.96 212.09,60.96 233.68,39.37 v233.68,36.83 | v236.22,34.29 v238.76,31.75
EQUIL
  Bottom 0.4: FLAGS.12 45.72,111.76 44.45,110.49 39.37,110.49 36.83,107.95 FLAG.4
FCP
  Top 0.4: FLAGS.11 48.26,114.3 45.72,116.84 31.75,116.84 30.48,118.11 CONTROL.1
GD  (via drill 0.35)
  Top 0.4: CMPH.5 229.87,21.59 v240.03,31.75 | v237.49,34.29 234.95,36.83 v234.95,38.1 | v234.95,59.69 v234.95,64.77 | v125.73,64.77 v106.68,64.77 | v100.71,55.5 84.2,55.5 v81.28,58.42 | v72.39,96.52 59.69,109.22 v48.26,109.22 | v45.72,109.22 43.18,109.22 40.64,111.76 FLAGS.14
  Bottom 0.4: v240.03,31.75 v237.49,34.29 | v234.95,38.1 v234.95,59.69 | v234.95,64.77 v125.73,64.77 | v106.68,64.77 106.68,59.69 102.49,55.5 v100.71,55.5 | v81.28,58.42 72.39,67.31 v72.39,96.52 | v48.26,109.22 v45.72,109.22
GND  (via drill 0.35)  (2 unrouted)
  Top 0.4: CMPL.2 196.85,13.97 197.49,14.61 | CMPL.4 196.72,19.05 197.49,18.29 197.49,14.61 | C10.- ADDPS.1 | 197.49,14.61 198.12,13.97 198.12,11.43 196.85,10.16 186.69,10.16 185.42,11.43 185.42,15.24 C5.- 143.51,17.78 C4.- ANDPS.1 | OUTPS.1 100.84,64.64 100.71,64.52 96.9,64.52 90.17,71.25 R0.1 | v125.73,50.8 106.68,50.8 C3.- | v167.64,140.97 v177.8,140.97 | C7.- v143.51,149.86 | ACCPS.1 19.05,29.21 16.51,31.75 v16.51,72.39 | v17.78,95.25 17.78,109.22 C9.- 24.13,115.57 45.72,115.57 46.99,114.3 46.99,106.68 FLAGS.10 v61.72,105.41 | C6.- 234.95,30.48 240.41,35.94 | 240.41,35.94 242.57,38.1 v242.57,39.37 | R7.1 90.17,104.14 99.06,113.03 101.6,113.03 102.87,114.3 v102.87,115.57 | SL.2 97.79,116.84 96.52,118.11 96.52,135.89 97.79,137.16 SL.10 | RZF.1 240.41,35.94
  Bottom 0.4: R0.1 R1.1 R2.1 R3.1 R4.1 R5.1 R6.1 R7.1 77.47,105.41 v61.72,105.41 | SR.9 SR.10 87.63,138.43 97.79,138.43 SL.10 99.06,146.05 102.87,149.86 C7.- | ORPS.1 201.93,35.56 203.2,34.29 212.09,34.29 CMPH.8 218.44,29.21 219.2,28.45 219.2,26.67 | CMPL.4 194.31,19.05 193.55,19.81 193.55,28.45 194.31,29.21 CMPL.8 | CMPL.2 201.93,13.97 206.12,9.78 218.06,9.78 219.2,10.92 219.2,26.67 | C6.- 224.79,26.67 219.2,26.67 | OUTPS.1 100.84,57.66 C3.- | ACCPS.1 C2.- 16.51,10.16 C1.- PS.1 | ANDPS.1 137.16,46.99 133.35,50.8 v125.73,50.8 | C8.- 182.88,160.02 | NOTPS.1 198.5,157.23 195.71,160.02 182.88,160.02 | XORPS.1 147.32,149.86 | 147.32,149.86 156.21,140.97 v167.64,140.97 | 182.88,160.02 181.61,161.29 179.07,161.29 177.8,160.02 v177.8,140.97 | v143.51,149.86 147.32,149.86 | v16.51,72.39 16.51,93.98 v17.78,95.25 | v242.57,39.37 267.97,64.77 ADDPS.1 | v102.87,115.57 101.6,116.84 SL.2 | RNG.1 ROF.1 RZF.1
GREATER
  Bottom 0.4: FLAGS.15 38.1,111.76 34.29,107.95 FLAG.2
LD  (via drill 0.35)
  Top 0.4: v232.41,27.94 231.14,26.67 CMPH.7 | v233.68,31.75 231.14,34.29 231.14,36.83 222.25,45.72 166.37,45.72 v163.83,48.26 | v125.73,55.88 105.41,55.88 101.6,59.69 57.15,59.69 50.8,66.04 50.8,90.17 43.18,97.79 v43.18,100.33
  Bottom 0.4: v232.41,27.94 232.41,30.48 v233.68,31.75 | v163.83,48.26 156.21,55.88 v125.73,55.88 | v43.18,100.33 FLAGS.8
LESS
  Top 0.4: FLAG.6 43.18,102.87 44.45,102.87 45.72,104.14 FLAGS.9
N$1
  Bottom 0.4: ROF.2 LOF.K
N$2
  Bottom 0.4: LZF.K RZF.2
N$3
  Bottom 0.4: LNG.K RNG.2
N$26
  Top 0.4: CMPH.4 218.19,19.05 219.84,17.4 219.84,10.29 218.57,9.02 208.03,9.02 205.74,11.3 205.74,20.32 204.47,21.59 CMPL.5
N$27
  Top 0.4: CMPH.3 218.44,16.51 218.95,16 218.95,10.54 218.19,9.78 208.79,9.78 206.63,11.94 206.63,20.7 203.2,24.13 CMPL.6
N$28
  Top 0.4: CMPL.7 204.47,26.67 207.52,23.62 207.52,13.46 208.41,12.57 215.77,12.57 CMPH.2
NEGATIVE
  Top 0.4: FLAG.3 36.83,95.25 35.56,93.98 33.02,93.98 31.75,95.25 31.75,100.33 35.56,104.14 FLAGS.5
NG  (via drill 0.35)
  Top 0.4: v30.48,99.06 30.48,95.25 v31.75,93.98 | v68.58,95.25 71.12,95.25 87.63,78.74 87.63,71.12 95.25,63.5 v140.97,63.5 | NG.1 307.34,31.75 275.59,63.5 v256.54,63.5
  Bottom 0.4: FLAGS.4 33.02,101.6 v30.48,99.06 | v31.75,93.98 67.31,93.98 v68.58,95.25 | v140.97,63.5 v256.54,63.5 | LNG.A 302.77,22.1 307.34,26.67 NG.1
NOT-OE  (via drill 0.35)
  Top 0.4: NOTCT.1 221.36,157.61 213.87,165.1 115.57,165.1 90.17,139.7 74.93,139.7 63.5,128.27 v62.23,128.27
  Bottom 0.4: v62.23,128.27 57.15,123.19 41.91,123.19 40.64,124.46 CONTROL.9
OF  (via drill 0.35)
  Top 0.4: v115.57,52.07 v133.35,52.07 | v232.41,35.56 v234.95,33.02
  Bottom 0.4: FLAGS.7 41.91,104.14 41.91,99.06 44.45,96.52 68.58,96.52 71.12,93.98 71.12,66.04 85.09,52.07 v115.57,52.07 | v133.35,52.07 157.48,52.07 163.83,45.72 225.55,45.72 232.41,38.86 v232.41,35.56 | v234.95,33.02 241.3,26.67 283.21,26.67 284.48,27.94 | 284.48,27.94 OF.1 | LOF.A 284.48,27.94
OR-OE  (via drill 0.35)
  Top 0.4: v228.6,40.89 181.86,87.63 v176.53,87.63 | v161.29,90.17 160.02,91.44 160.02,97.79 115.57,142.24 v93.98,142.24 | v80.01,142.24 74.93,142.24 60.96,128.27 57.15,128.27 54.61,130.81 41.91,130.81 40.64,129.54 CONTROL.10
  Bottom 0.4: v176.53,87.63 163.83,87.63 v161.29,90.17 | v93.98,142.24 v80.01,142.24 | ORCT.1 v228.6,40.89
OUT-CP  (via drill 0.35)
  Top 0.4: v67.31,106.68 82.55,91.44 82.55,86.36 87.63,81.28 91.44,81.28 92.71,80.01 92.71,73.66 94.11,72.26 OUTCT.2 | v55.88,118.11 52.07,118.11 48.26,121.92 44.45,121.92 43.18,123.19 CONTROL.11
  Bottom 0.4: v55.88,118.11 v67.31,106.68
OUT-OE  (via drill 0.35)
  Top 0.4: OUTCT.1 96.65,69.72 v96.52,69.85 | v88.9,100.33 76.2,113.03 v64.77,113.03 | CONTROL.12 43.18,129.54 43.69,130.05 47.75,130.05 v59.69,118.11
  Bottom 0.4: v96.52,69.85 95.25,71.12 95.25,93.98 v88.9,100.33 | v64.77,113.03 v59.69,118.11
OVERFLOW
  Bottom 0.4: FLAG.5 40.64,97.79 40.64,101.6 38.1,104.14 FLAGS.6
Q0
  Top 0.4: OUTI.8 147.19,74.8 151.13,78.74 ANDO.8 XORO.8 | NOTO.8 ORO.8 215.9,76.2 241.3,50.8 284.48,50.8 304.8,30.48 ADDO.8 | SR.18 80.01,118.11 90.17,118.11 SL.18
  Bottom 0.4: NOTO.8 215.9,100.33 210.82,105.41 194.18,105.41 190.37,101.6 190.37,95.12 186.69,91.44 ANDO.8 | R0.2 97.92,74.8 OUTI.8 111.63,74.8 114.3,77.47 114.3,100.33 101.73,112.9 77.34,112.9 76.96,113.28 76.96,117.73 78.61,119.38 SR.18
Q1
  Top 0.4: OUTI.7 144.65,77.34 148.59,81.28 ANDO.7 XORO.7 | NOTO.7 ORO.7 213.36,76.2 240.03,49.53 283.21,49.53 302.26,30.48 ADDO.7 | SL.17 90.17,120.65 80.01,120.65 SR.17
  Bottom 0.4: ANDO.7 148.59,88.9 151.64,85.85 182.5,85.85 191.26,94.61 191.26,101.09 194.69,104.52 209.17,104.52 213.36,100.33 NOTO.7 | R1.2 100.71,77.47 OUTI.7 100.97,77.47 110.49,77.47 113.03,80.01 113.03,97.79 98.68,112.14 76.71,112.14 76.07,112.78 76.07,120.52 77.47,121.92 SR.17
Q2
  Top 0.4: OUTI.6 142.11,79.88 146.05,83.82 ANDO.6 XORO.6 | NOTO.6 ORO.6 210.82,76.2 238.76,48.26 281.94,48.26 299.72,30.48 ADDO.6 | SR.16 80.01,123.19 90.17,123.19 SL.16
  Bottom 0.4: ANDO.6 146.05,86.36 147.57,84.84 182.88,84.84 192.15,94.11 192.15,100.71 195.07,103.63 208.53,103.63 210.82,101.35 NOTO.6 | R2.2 97.92,79.88 OUTI.6 110.36,79.88 112.01,81.53 112.01,96.39 97.03,111.38 76.07,111.38 75.18,112.27 75.18,122.17 77.47,124.46 SR.16
Q3
  Top 0.4: OUTI.5 139.57,82.42 143.51,86.36 ANDO.5 XORO.5 | NOTO.5 ORO.5 208.28,76.2 237.49,46.99 280.67,46.99 297.18,30.48 ADDO.5 | SR.15 80.01,125.73 90.17,125.73 SL.15
  Bottom 0.4: NOTO.5 208.28,99.06 204.6,102.74 195.45,102.74 193.17,100.46 193.17,93.73 183.39,83.95 145.92,83.95 143.51,86.36 ANDO.5 | R3.2 100.71,82.55 OUTI.5 109.73,82.42 111,83.69 111,96.01 96.39,110.62 75.56,110.62 74.3,111.89 74.3,123.83 77.47,127 SR.15
Q4
  Top 0.4: OUTI.4 138.3,84.96 140.97,87.63 ANDO.4 XORO.4 | NOTO.4 ORO.4 205.74,76.2 236.22,45.72 279.4,45.72 294.64,30.48 ADDO.4 | SR.14 80.01,128.27 90.17,128.27 SL.14
  Bottom 0.4: ANDO.4 140.97,86.36 144.27,83.06 184.02,83.06 193.93,92.96 193.93,99.95 195.83,101.85 203.58,101.85 205.74,99.69 NOTO.4 | R4.2 97.92,84.96 OUTI.4 109.09,84.96 109.73,85.6 109.73,95.76 95.76,109.73 75.06,109.73 73.53,111.25 73.53,124.33 SR.14
Q5
  Top 0.4: OUTI.3 137.03,87.5 138.43,88.9 ANDO.3 XORO.3 | NOTO.3 ORO.3 203.2,76.2 234.95,44.45 278.13,44.45 292.1,30.48 ADDO.3 | SR.13 80.01,130.81 90.17,130.81 SL.13
  Bottom 0.4: NOTO.3 203.2,99.06 201.29,100.97 196.34,100.97 194.94,99.57 194.94,92.58 184.53,82.17 141.35,82.17 138.43,85.09 ANDO.3 | R5.2 100.71,87.63 OUTI.3 100.97,87.63 105.41,87.63 107.95,90.17 107.95,95.25 94.49,108.71 74.8,108.71 72.52,111 72.52,125.86 SR.13
Q6
  Top 0.4: OUTI.2 130.94,90.04 132.08,88.9 134.62,88.9 135.89,90.17 ANDO.2 XORO.2 | NOTO.2 ORO.2 200.66,76.2 233.68,43.18 276.86,43.18 289.56,30.48 ADDO.2 | SR.12 80.01,133.35 90.17,133.35 SL.12
  Bottom 0.4: ANDO.2 135.89,85.09 139.7,81.28 185.42,81.28 195.83,91.69 195.83,99.06 196.72,99.95 199.14,99.95 200.66,98.42 NOTO.2 | R6.2 97.92,90.04 OUTI.2 104.01,90.04 105.41,91.44 105.41,95.25 92.96,107.7 74.42,107.7 71.75,110.36 71.75,127.64 SR.12
Q7
  Top 0.4: OUTI.1 132.21,92.58 ANDO.1 XORO.1 | NOTO.1 ORO.1 198.12,76.2 232.41,41.91 274.32,41.91 ADDO.1 | SR.11 80.01,135.89 90.17,135.89 SL.11
  Bottom 0.4: ANDO.1 133.35,83.82 137.16,80.01 186.69,80.01 ORO.1 | R7.2 100.71,92.71 OUTI.1 100.33,93.09 100.33,97.79 91.31,106.81 73.66,106.81 71.12,109.35 71.12,129.54 SR.11
SL-OE
  Bottom 0.4: SL.19 90.17,116.84 88.9,118.11 82.55,118.11 81.28,119.38 81.28,137.16 80.01,138.43 76.2,138.43 58.42,120.65 38.1,120.65 35.56,123.19 CONTROL.5
SR-OE
  Top 0.4: SR.19 52.07,116.84 49.53,119.38 35.56,119.38 33.02,121.92 CONTROL.3
SUB
  Bottom 0.4: CONTROL.13 52.07,132.08 64.77,132.08 97.79,165.1 215.9,165.1 242.57,138.43 SUB.1
VCC  (via drill 0.35)
  Top 0.4: SL.20 SR.1 SR.20 52.07,114.3 48.26,118.11 v33.02,118.11 | SL.20 SL.1 100.33,114.3 101.6,115.57 v101.6,120.65 | CMPL.16 190.5,11.43 CMPL.3 | 265.43,98.32 C10.+ ADDPS.2 | v139.7,48.26 133.35,54.61 v115.57,54.61 | C4.+ ANDPS.2 | v177.8,138.43 152.4,138.43 144.78,146.05 144.78,147.32 | 144.78,147.32 XORPS.2 | C7.+ 144.78,147.32 | SL.20 91.44,107.95 v88.9,105.41
  Bottom 0.4: CMPH.16 207.01,11.43 201.93,16.51 CMPL.3 | ORPS.2 206.38,34.92 214,34.92 218.44,30.48 C6.+ 226.06,31.75 227.33,33.02 228.6,33.02 229.87,31.75 | 229.87,31.75 229.87,29.21 228.6,27.94 227.33,27.94 220.22,20.83 220.22,10.67 218.44,8.89 194.31,8.89 191.77,11.43 CMPL.16 186.69,11.43 C5.+ 180.34,15.24 171.45,24.13 C4.+ | 98.11,66.99 97.79,66.67 C3.+ 100.33,54.61 v115.57,54.61 | 98.11,66.99 OUTPS.2 | PS.2 C1.+ 8.89,19.05 C2.+ ACCPS.2 15.24,38.1 15.24,95.25 FLAGS.1 | v139.7,48.26 ANDPS.2 | NOTPS.2 181.61,156.21 C8.+ 179.07,139.7 v177.8,138.43 | v101.6,120.65 101.6,132.08 104.14,134.62 C7.+ | C9.+ 22.86,107.95 FLAGS.1 | FLAGS.1 FLAGS.20 25.4,114.3 29.21,118.11 v33.02,118.11 | ADDPS.2 265.43,64.77 232.41,31.75 229.87,31.75 | v88.9,105.41 96.52,97.79 96.52,72.26 98.11,70.67 98.11,66.99
XOR-OE  (via drill 0.35)
  Top 0.4: v105.41,152.4 XORCT.1
  Bottom 0.4: v105.41,152.4 87.63,152.4 57.15,121.92 40.64,121.92 38.1,124.46 CONTROL.7
ZERO
  Bottom 0.4: FLAG.1 30.48,96.52 27.94,99.06 FLAGS.2
ZF  (via drill 0.35)
  Top 0.4: FLAGS.3 30.48,106.68 31.75,107.95 v44.45,107.95 | v94.49,62.23 v140.97,62.23 | v259.08,62.23 261.62,59.69 v261.62,54.61 | LZF.A 272.54,19.81 ZF.1
  Bottom 0.4: v94.49,62.23 88.9,67.82 88.9,86.36 77.47,97.79 59.69,97.79 49.53,107.95 v44.45,107.95 | v140.97,62.23 v259.08,62.23 | v261.62,54.61 278.13,38.1 278.13,33.02 ZF.1

### Text on the board
tPlace: NOT | XOR | ADDER | AND | OR | ZERO | OVERFLOW | NEGATIVE